# Altium project rgb_card.PrjPcb (part 2 of 4)

## Sheet memory.SchDoc
size A4
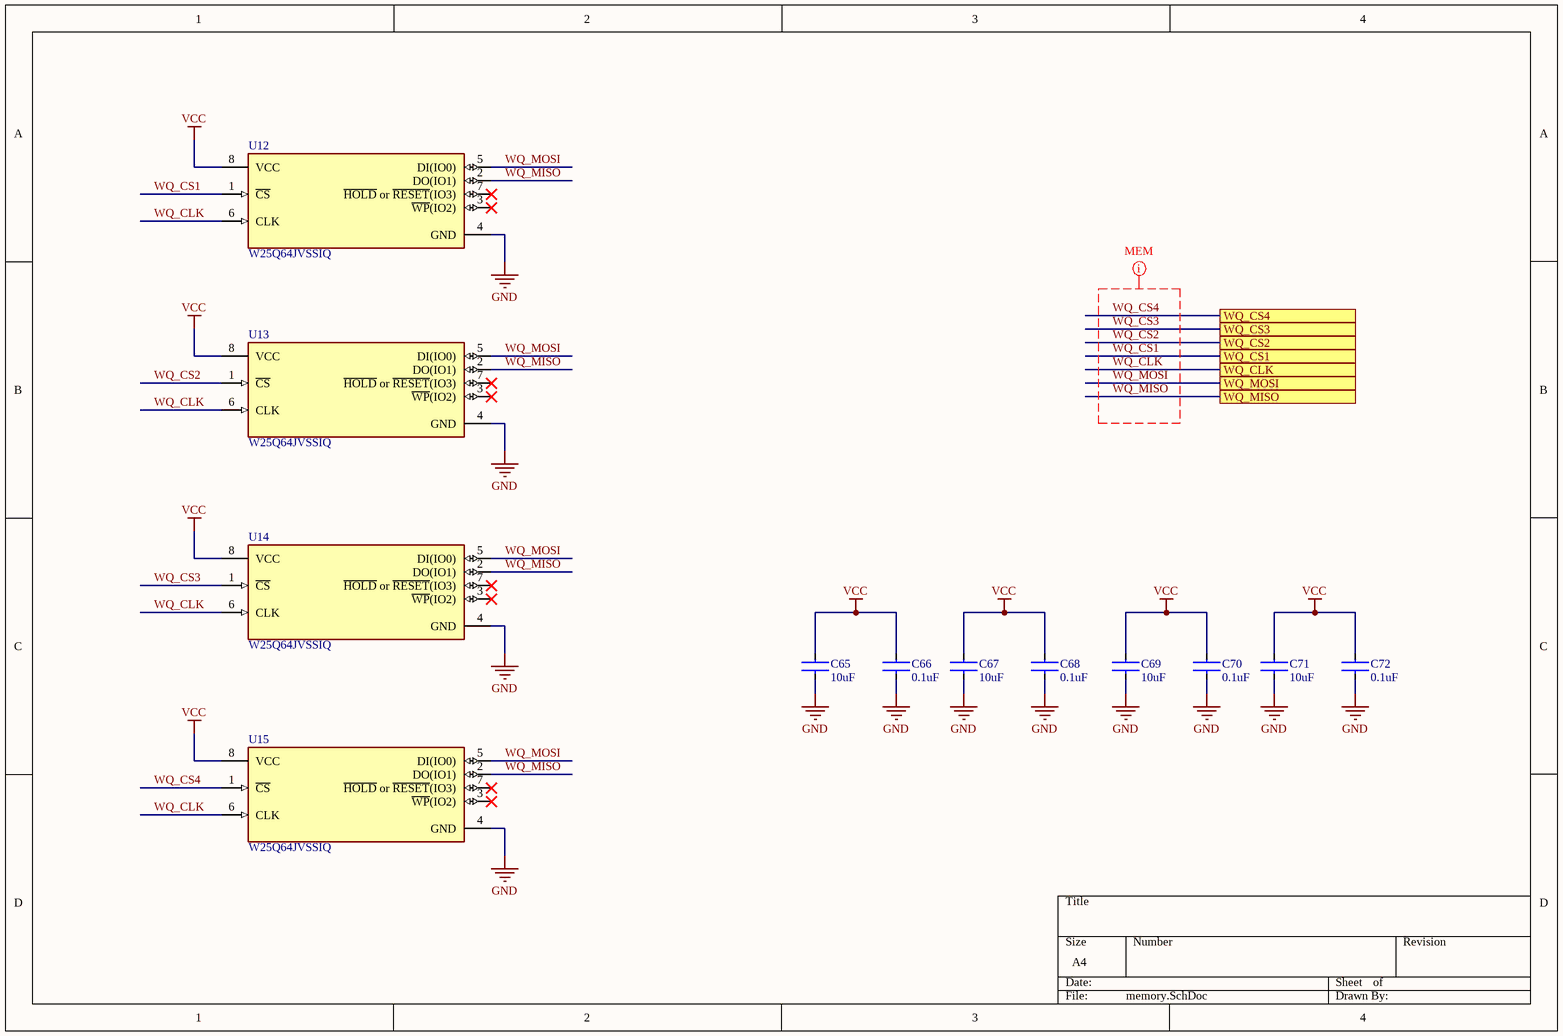
[diagram p5: memory.SchDoc]

### Parts
C65  10uF  [C0402]
C66  0.1uF  [C0402]
C67  10uF  [C0402]
C68  0.1uF  [C0402]
C69  10uF  [C0402]
C70  0.1uF  [C0402]
C71  10uF  [C0402]
C72  0.1uF  [C0402]
U12  W25Q64JVSSIQ  [SOIC-8]
U13  W25Q64JVSSIQ  [SOIC-8]
U14  W25Q64JVSSIQ  [SOIC-8]
U15  W25Q64JVSSIQ  [SOIC-8]

### Ports
WQ_CLK, WQ_CS1, WQ_CS2, WQ_CS3, WQ_CS4, WQ_MISO, WQ_MOSI

### Nets
GND: C65.2 C66.2 C67.2 C68.2 C69.2 C70.2 C71.2 C72.2 U12.4(GND) U13.4(GND) U14.4(GND) U15.4(GND)
VCC: C65.1 C66.1 C67.1 C68.1 C69.1 C70.1 C71.1 C72.1 U12.8(VCC) U13.8(VCC) U14.8(VCC) U15.8(VCC)
WQ_CLK: U12.6(CLK) U13.6(CLK) U14.6(CLK) U15.6(CLK) ; port WQ_CLK  [project net MEM_SCK]
WQ_CS1: U12.1(~{CS}) ; port WQ_CS1  [project net MEM_CS1]
WQ_CS2: U13.1(~{CS}) ; port WQ_CS2  [project net MEM_CS2]
WQ_CS3: U14.1(~{CS}) ; port WQ_CS3  [project net MEM_CS3]
WQ_CS4: U15.1(~{CS}) ; port WQ_CS4  [project net MEM_CS4]
WQ_MISO: U12.2(DO(IO1)) U13.2(DO(IO1)) U14.2(DO(IO1)) U15.2(DO(IO1)) ; port WQ_MISO  [project net MEM_MOSI]
WQ_MOSI: U12.5(DI(IO0)) U13.5(DI(IO0)) U14.5(DI(IO0)) U15.5(DI(IO0)) ; port WQ_MOSI  [project net MEM_MISO]

Not connected (* = marked no-connect by the designer): U12 3(~{WP}(IO2))* 7(~{HOLD}_or_~{RESET}(IO3))*; U13 3(~{WP}(IO2))* 7(~{HOLD}_or_~{RESET}(IO3))*; U14 3(~{WP}(IO2))* 7(~{HOLD}_or_~{RESET}(IO3))*; U15 3(~{WP}(IO2))* 7(~{HOLD}_or_~{RESET}(IO3))*

### Layout directives
net class MEM: WQ_CLK, WQ_CS1, WQ_CS2, WQ_CS3, WQ_CS4, WQ_MISO, WQ_MOSI

### Library data of the parts
C65 C67 C69 C71 = CL31B106KOHNNNE: Cap Ceramic 10uF 16V X7R 10% Pad SMD 1206 125°C T/R; Manufacturer: Samsung; Supplier 1: Future Electronics; Manufacturer Part Number: CL31B106KOHNNNE; RoHS: Yes; Category: Ceramic Capacitors; Stock 1: 116000; Pricing 1: 2000=0.03800, 6000=0.03460, 8000=0.03450, 20000=0.03420, 30000=0.03400 (USD); Mount: Surface Mount; Case/Package: 1206; Case Code (Metric): 3216; Case Code (Imperial): 1206; Material: Ceramic; Contact Plating: Tin; Min Operating Temperature: -55°C; Max Operating Temperature: 125°C; Capacitance: 10uF; Tolerance: 10%; Dielectric: X7R; Package Quantity: 1; Packaging: Tape and Reel; Voltage Rating: 16V; Series: CL; Length: 3.2mm; Width: 0.063inch; Height: 1.6mm; Thickness: 0.071inch; Depth: 1.6mm; RoHS Compliant: Yes; ComponentLink1URL: https://datasheet.ciiva.com/25795/cl31b106kohnnne-25795201.pdf?src-supplier=Digi-Key; ComponentLink1Description: https://datasheet.ciiva.com/25795/cl31b106kohnnne-25795201.pdf?src-supplier=Digi-Key; ComponentLink2URL: https://datasheet.ciiva.com/29201/452535-da-01-en-vs-kondensator-1206-29201132.pdf?src-supplier=Conrad; ComponentLink2Description: https://datasheet.ciiva.com/29201/452535-da-01-en-vs-kondensator-1206-29201132.pdf?src-supplier=Conrad; Supplier Part Number 1: 2558872
C66 C68 C70 C72 = CL31B104KBCNNNC: Ceramic capacitor SMD-1206 100nF /50V X7R# K +-10%, Samsung, RoHS; Tolerance: 10%; Dielectric: X7R; Voltage: 50V; Supplier 1: Arrow Electronics; Manufacturer: Samsung; Manufacturer Part Number: CL31B104KBCNNNC; RoHS: Yes; Category: Ceramic Capacitors; Stock 1: 3508000; Pricing 1: 4000=0.02060, 8000=0.01660 (USD); Mount: Surface Mount; Case/Package: 1206; Case Code (Metric): 3216; Case Code (Imperial): 1206; Material: Ceramic; Contact Plating: Tin; Min Operating Temperature: -55°C; Max Operating Temperature: 125°C; Capacitance: 100nF; Voltage Rating (DC): 50V; Packaging: Tape and Reel; Voltage Rating: 50V; Series: CL; Length: 3.2mm; Width: 0.063inch; Height: 0.85mm; Depth: 1.6mm; Thickness: 0.037inch; Radiation Hardening: No; Lead Free: Lead Free; RoHS Compliant: Yes; ComponentLink1URL: https://datasheet.ciiva.com/25710/cl31b104kbcnnnc-25710293.pdf?src-supplier=Digi-Key; ComponentLink1Description: https://datasheet.ciiva.com/25710/cl31b104kbcnnnc-25710293.pdf?src-supplier=Digi-Key; ComponentLink2URL: https://datasheet.ciiva.com/29201/451941-da-01-en-vs-kondensator-1206-29201689.pdf?src-supplier=Conrad; ComponentLink2Description: https://datasheet.ciiva.com/29201/451941-da-01-en-vs-kondensator-1206-29201689.pdf?src-supplier=Conrad; ComponentLink3URL: https://datasheet.ciiva.com/16298/cl05b104kq5nnnc-16298186.pdf?src-supplier=Future+Electronics; ComponentLink3Description: https://datasheet.ciiva.com/16298/cl05b104kq5nnnc-16298186.pdf?src-supplier=Future+Electronics; Supplier Part Number 1: CL31B104KBCNNNC
U12-U15 = W25Q64JVSSIQ: IC FLASH 64MBIT 104MHZ 8SOIC; Manufacturer: Winbond; Memory Type: FLASH,NOR; Interface: SPI,Serial; Max Supply Voltage: 3.6V; Min Supply Voltage: 2.7V; Page Size: 256B; Density: 64MB; Operating Supply Voltage: 3V; Address Bus Width: 24b; Access Time: 6ns; Supplier 1: Arrow Electronics; Manufacturer Part Number: W25Q64JVSSIQ; RoHS: Yes; Category: Flash; Stock 1: 24923; Pricing 1: 1=1.14900, 10=1.03090, 25=1.01110, 50=1.00110, 100=0.92440, 250=0.91670, 500=0.90340, 1000=0.87160, 5000=0.77800 (USD); Mount: Surface Mount; Case/Package: SOIC; Number of Pins: 8; Min Operating Temperature: -40°C; Max Operating Temperature: 85°C; Packaging: Tray; Frequency: 104MHz; RoHS Compliant: Yes; ComponentLink1URL: http://www.winbond.com/resource-files/w25q64jv%20revj%2003272018%20plus.pdf?src-supplier=Digi-Key; ComponentLink1Description: http://www.winbond.com/resource-files/w25q64jv%20revj%2003272018%20plus.pdf?src-supplier=Digi-Key; Supplier Part Number 1: W25Q64JVSSIQ

## Sheet wifi.SchDoc
size A
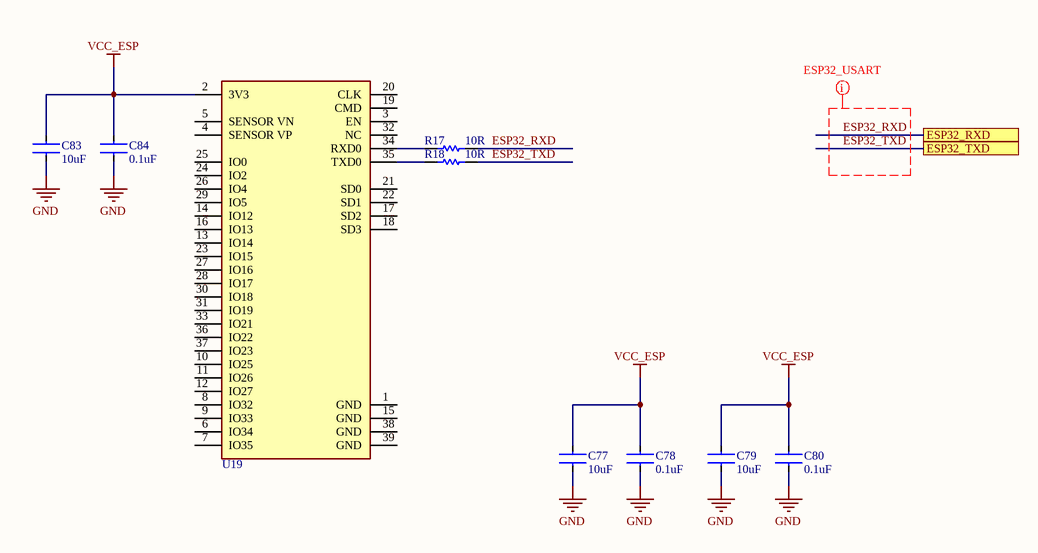
[diagram p6: wifi.SchDoc]

### Parts
C77  10uF  [C0402]
C78  0.1uF  [C0402]
C79  10uF  [C0402]
C80  0.1uF  [C0402]
C83  10uF  [C0402]
C84  0.1uF  [C0402]
R17  10R  [R0402]
R18  10R  [R0402]
U19  BLE/WIFI Module  [Espressif_ESP-WROOM-32_0]  (value not drawn)

### Ports
ESP32_RXD, ESP32_TXD

### Nets
GND: C77.2 C78.2 C79.2 C80.2 C83.2 C84.2
VCC_ESP: C77.1 C78.1 C79.1 C80.1 C83.1 C84.1 U19.2(3V3)  [project net ETH_VCC]
ESP32_RXD: R17.2 ; port ESP32_RXD
ESP32_TXD: R18.2 ; port ESP32_TXD
NetR17_1: R17.1 U19.34(RXD0)
NetR18_1: R18.1 U19.35(TXD0)

Not connected (* = marked no-connect by the designer): U19 1(GND) 3(EN) 4(SENSOR_VP) 5(SENSOR_VN) 6(IO34) 7(IO35) 8(IO32) 9(IO33) 10(IO25) 11(IO26) 12(IO27) 13(IO14) 14(IO12) 15(GND) 16(IO13) 17(SD2) 18(SD3) 19(CMD) 20(CLK) 21(SD0) 22(SD1) 23(IO15) 24(IO2) 25(IO0) 26(IO4) 27(IO16) 28(IO17) 29(IO5) 30(IO18) 31(IO19) 32(NC) 33(IO21) 36(IO22) 37(IO23) 38(GND) 39(GND)

### Layout directives
net class USP32_USART: ESP32_RXD, ESP32_TXD

### Library data of the parts
C77 C79 C83 = CL31B106KOHNNNE: as C65 on sheet memory; Supplier 1: Future Electronics; Manufacturer Part Number: CL31B106KOHNNNE; RoHS: Yes; Category: Ceramic Capacitors; Stock 1: 116000; Pricing 1: 2000=0.03800, 6000=0.03460, 8000=0.03450, 20000=0.03420, 30000=0.03400 (USD); Mount: Surface Mount; Case/Package: 1206; Case Code (Metric): 3216; Case Code (Imperial): 1206; Material: Ceramic; Contact Plating: Tin; Min Operating Temperature: -55°C; Max Operating Temperature: 125°C; Capacitance: 10uF; Tolerance: 10%; Dielectric: X7R; Package Quantity: 1; Packaging: Tape and Reel; Voltage Rating: 16V; Series: CL; Length: 3.2mm; Width: 0.063inch; Height: 1.6mm; Thickness: 0.071inch; Depth: 1.6mm; RoHS Compliant: Yes; ComponentLink1URL: https://datasheet.ciiva.com/25795/cl31b106kohnnne-25795201.pdf?src-supplier=Digi-Key; ComponentLink1Description: https://datasheet.ciiva.com/25795/cl31b106kohnnne-25795201.pdf?src-supplier=Digi-Key; ComponentLink2URL: https://datasheet.ciiva.com/29201/452535-da-01-en-vs-kondensator-1206-29201132.pdf?src-supplier=Conrad; ComponentLink2Description: https://datasheet.ciiva.com/29201/452535-da-01-en-vs-kondensator-1206-29201132.pdf?src-supplier=Conrad; Supplier Part Number 1: 2558872
C78 C80 C84 = CL31B104KBCNNNC: as C66 on sheet memory; Supplier 1: Arrow Electronics; Manufacturer: Samsung; Manufacturer Part Number: CL31B104KBCNNNC; RoHS: Yes; Category: Ceramic Capacitors; Stock 1: 3508000; Pricing 1: 4000=0.02060, 8000=0.01660 (USD); Mount: Surface Mount; Case/Package: 1206; Case Code (Metric): 3216; Case Code (Imperial): 1206; Material: Ceramic; Contact Plating: Tin; Min Operating Temperature: -55°C; Max Operating Temperature: 125°C; Capacitance: 100nF; Voltage Rating (DC): 50V; Packaging: Tape and Reel; Voltage Rating: 50V; Series: CL; Length: 3.2mm; Width: 0.063inch; Height: 0.85mm; Depth: 1.6mm; Thickness: 0.037inch; Radiation Hardening: No; Lead Free: Lead Free; RoHS Compliant: Yes; ComponentLink1URL: https://datasheet.ciiva.com/25710/cl31b104kbcnnnc-25710293.pdf?src-supplier=Digi-Key; ComponentLink1Description: https://datasheet.ciiva.com/25710/cl31b104kbcnnnc-25710293.pdf?src-supplier=Digi-Key; ComponentLink2URL: https://datasheet.ciiva.com/29201/451941-da-01-en-vs-kondensator-1206-29201689.pdf?src-supplier=Conrad; ComponentLink2Description: https://datasheet.ciiva.com/29201/451941-da-01-en-vs-kondensator-1206-29201689.pdf?src-supplier=Conrad; ComponentLink3URL: https://datasheet.ciiva.com/16298/cl05b104kq5nnnc-16298186.pdf?src-supplier=Future+Electronics; ComponentLink3Description: https://datasheet.ciiva.com/16298/cl05b104kq5nnnc-16298186.pdf?src-supplier=Future+Electronics; Supplier Part Number 1: CL31B104KBCNNNC
R17 R18 = RC1206FR-0710RL: Res Thick Film 1206 10 Ohm 1% 0.25W(1/4W) +/-200ppm/ßC Epoxy SMD T/R; Manufacturer: Yageo; Temperature Coefficient: 200ppm/°C; Voltage Rating (DC): 200V; Power Rating: 250mW; Supplier 1: Arrow Electronics; Manufacturer Part Number: RC1206FR-0710RL; RoHS: Yes; Category: Chip SMD Resistors; Stock 1: 60000; Pricing 1: 5000=0.02280 (USD); Case/Package: 1206; Number of Pins: 2; Case Code (Metric): 3216; Case Code (Imperial): 1206; Size Code: 1206; Min Operating Temperature: -55°C; Max Operating Temperature: 155°C; Tolerance: 1%; Resistance: 10R; Resistor Type: Thick Film; Packaging: Tape and Reel; Package Quantity: 1; Voltage Rating: 200V; Number of Terminations: 2; Termination: SMD/SMT; Max Power Dissipation: 250mW; Features: Moisture Resistant; Series: RC; Resistance Tolerance: 1%; Technology: THICK FILM; Construction: Rectangular; Length: 3.1mm; Width: 0.063inch; Height: 0.026inch; Depth: 1.6mm; REACH SVHC: Unknown; Lead Free: Lead Free; Military Standard: Not; RoHS Compliant: Yes; ComponentLink1URL: https://datasheet.ciiva.com/11819/0900766b80c6630a-11819896.pdf?src-supplier=RSComponents; ComponentLink1Description: https://datasheet.ciiva.com/11819/0900766b80c6630a-11819896.pdf?src-supplier=RSComponents; ComponentLink2URL: https://datasheet.ciiva.com/22735/444357-22735648.pdf?src-supplier=Farnell; ComponentLink2Description: https://datasheet.ciiva.com/22735/444357-22735648.pdf?src-supplier=Farnell; ComponentLink3URL: https://datasheet.ciiva.com/29181/402303-da-01-en-smd-widerstand-chip1206-10-ohm-29181572.pdf?src-supplier=Conrad; ComponentLink3Description: https://datasheet.ciiva.com/29181/402303-da-01-en-smd-widerstand-chip1206-10-ohm-29181572.pdf?src-supplier=Conrad; ComponentLink4URL: https://datasheet.ciiva.com/46445/444357-46445704.pdf?src-supplier=Element14; ComponentLink4Description: https://datasheet.ciiva.com/46445/444357-46445704.pdf?src-supplier=Element14; ComponentLink5URL: https://datasheet.ciiva.com/2460/pyu-rc1206-51-rohs-l-4-2460049.pdf?src-supplier=Digi-Key; ComponentLink5Description: https://datasheet.ciiva.com/2460/pyu-rc1206-51-rohs-l-4-2460049.pdf?src-supplier=Digi-Key; ComponentLink6URL: https://datasheet.ciiva.com/2460/pyu-rc1206-51-rohs-l-4-2460050.pdf?src-supplier=Digi-Key; ComponentLink6Description: https://datasheet.ciiva.com/2460/pyu-rc1206-51-rohs-l-4-2460050.pdf?src-supplier=Digi-Key; ComponentLink7URL: https://datasheet.ciiva.com/2460/pyu-rc1206-51-rohs-l-4-2460048.pdf?src-supplier=Digi-Key; ComponentLink7Description: https://datasheet.ciiva.com/2460/pyu-rc1206-51-rohs-l-4-2460048.pdf?src-supplier=Digi-Key; ComponentLink8URL: https://datasheet.ciiva.com/16962/pyu-rc1206-51-rohs-l-4-16962857.pdf?src-supplier=Future+Electronics; ComponentLink8Description: https://datasheet.ciiva.com/16962/pyu-rc1206-51-rohs-l-4-16962857.pdf?src-supplier=Future+Electronics; Supplier Part Number 1: RC1206FR-0710RL
U19 = IC_Espressif_ESP-WROOM-32_eec: IC SPRESSIF ESP32 BLUETOOTH WIFI Module; helpURL: https://upverter.com/upn/revision/247263e65b82b491/; ComponentLink2Description: Datasheet; Temperature: -40°C to +85°C; Package: MOD_SMT; Supplier 2: Mouser; Supplier 1: Digi-Key; ComponentLink1URL: https://upverter.com/upn/revision/247263e65b82b491/; Supplier Part Number 2: 485-3320; Supplier Part Number 1: 1188-1178-ND; Manufacturer: Espressif; ComponentLink1Description: Upverter; ComponentLink2URL: http://www.espressif.com/sites/default/files/documentation/esp-wroom-32_datasheet_en.pdf; RoHS: TRUE; Mouser Part Number: 485-3320; Temperature Range High: +85°C; Digikey Description: IC SPRESSIF ESP32 BLUETOOTH WIFI M; Digikey Part Number: 1188-1178-ND; Lead Free: yes; Temperature Range Low: -40°C; Part Number: ESP-WROOM-32

## Sheet hub75d.SchDoc
size A3
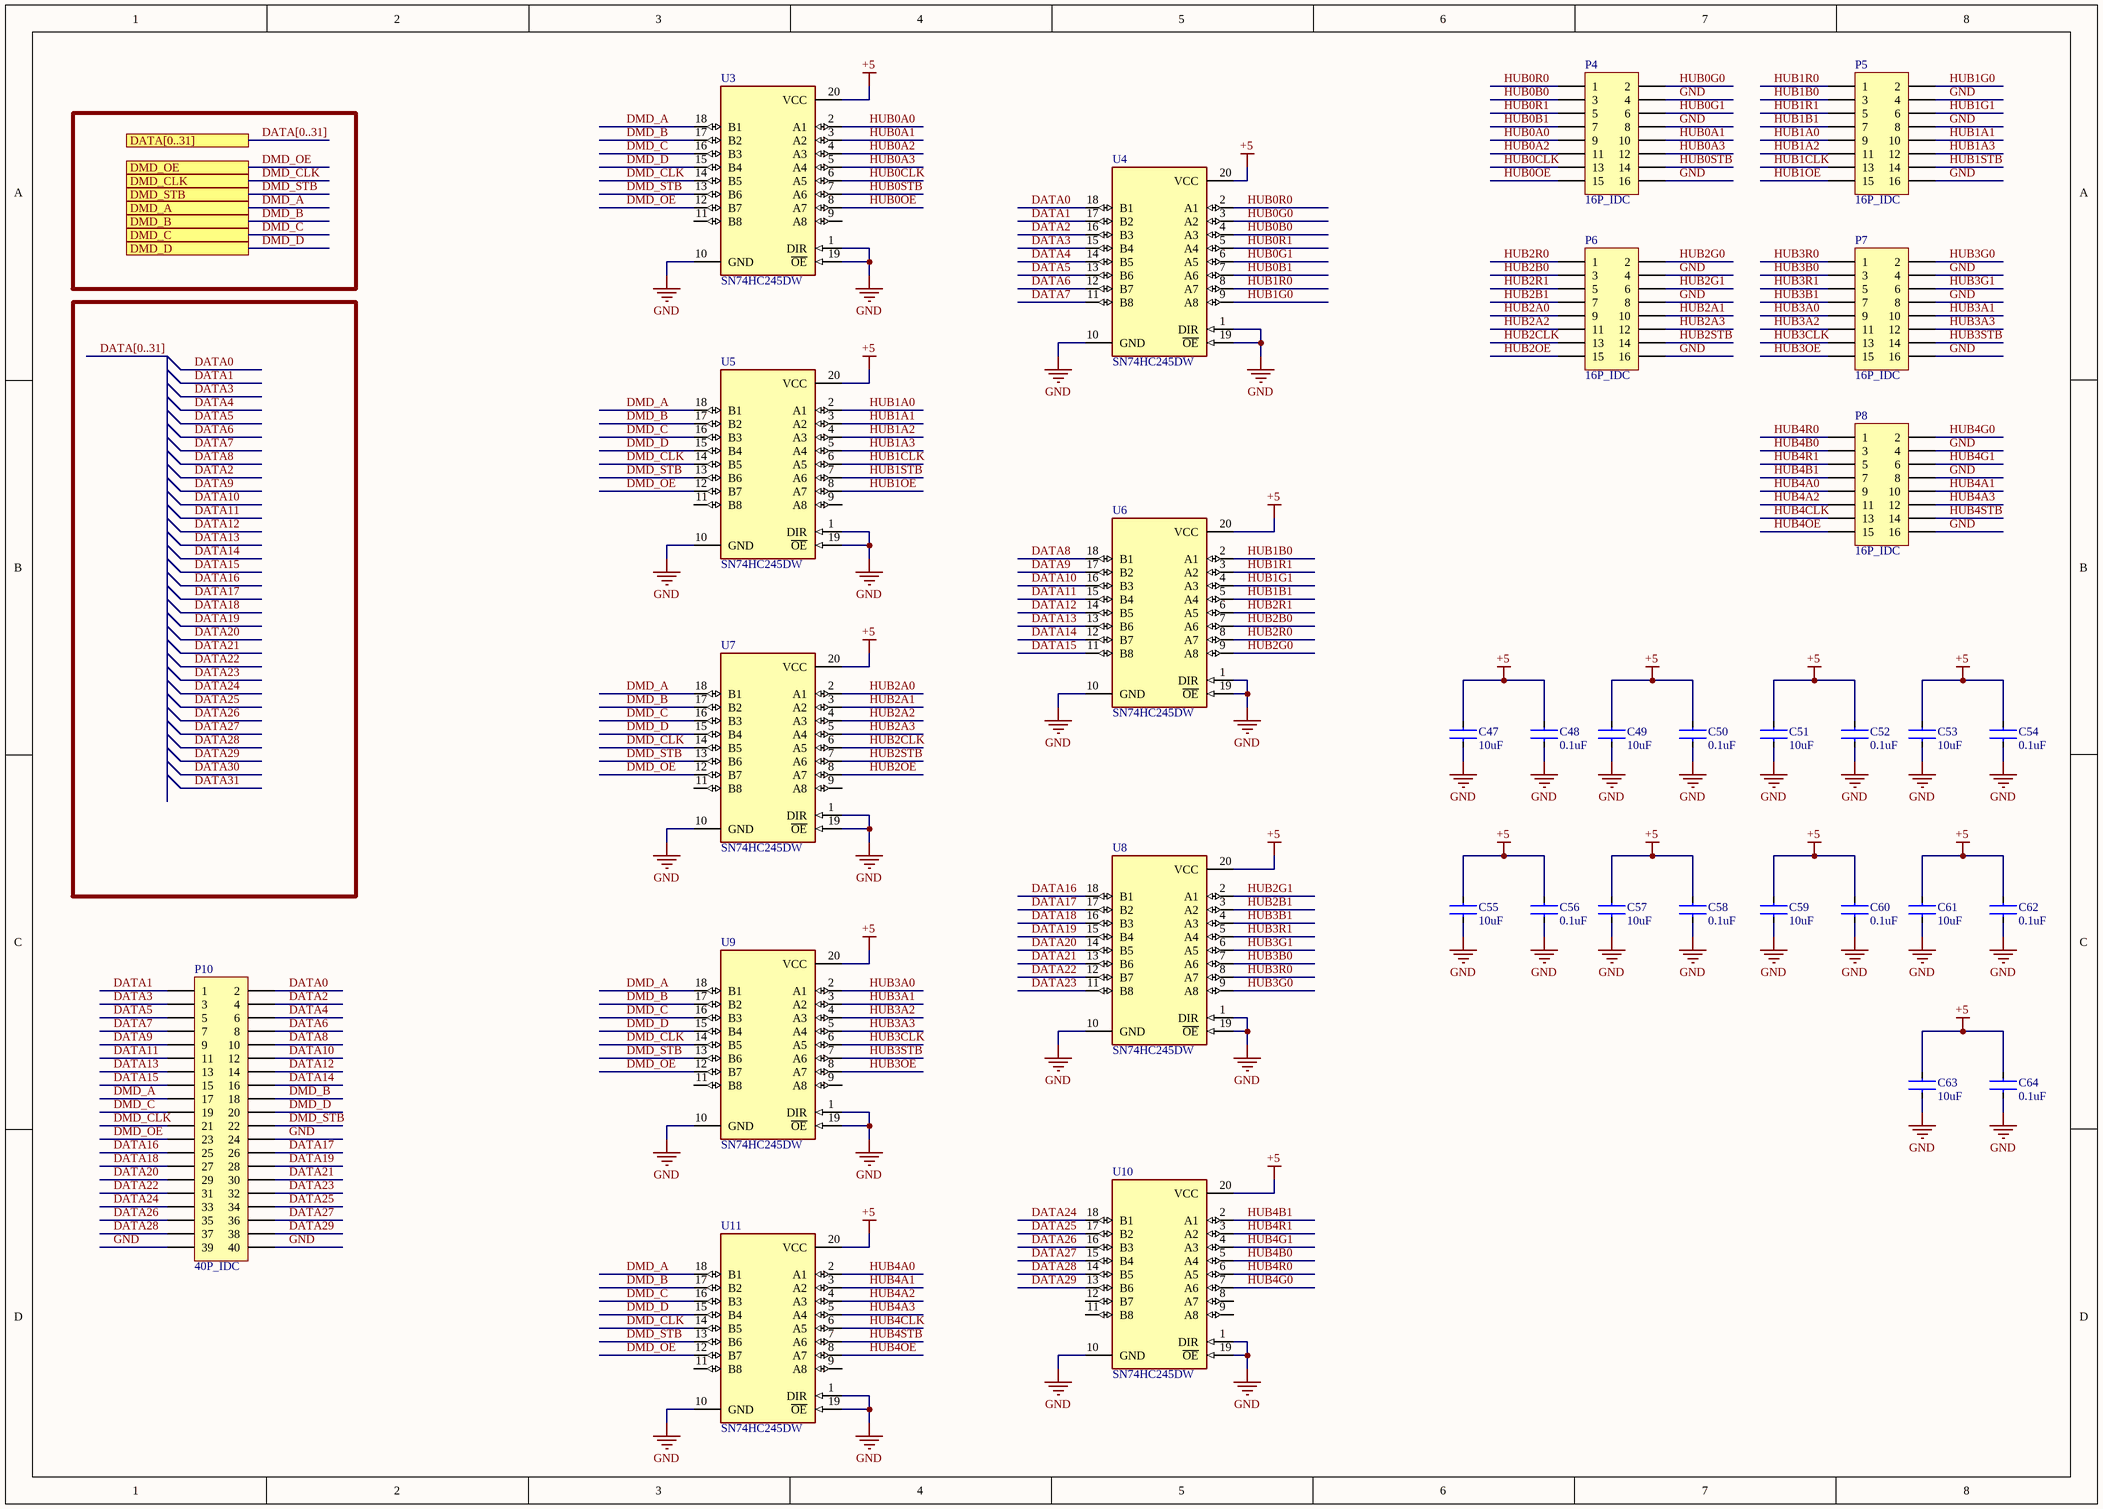
[diagram p7: hub75d.SchDoc]

### Parts
C47  10uF  [C0402]
C48  0.1uF  [C0402]
C49  10uF  [C0402]
C50  0.1uF  [C0402]
C51  10uF  [C0402]
C52  0.1uF  [C0402]
C53  10uF  [C0402]
C54  0.1uF  [C0402]
C55  10uF  [C0402]
C56  0.1uF  [C0402]
C57  10uF  [C0402]
C58  0.1uF  [C0402]
C59  10uF  [C0402]
C60  0.1uF  [C0402]
C61  10uF  [C0402]
C62  0.1uF  [C0402]
C63  10uF  [C0402]
C64  0.1uF  [C0402]
P4  16P_IDC  [16Pin_IDC_Connector]
P5  16P_IDC  [16Pin_IDC_Connector]
P6  16P_IDC  [16Pin_IDC_Connector]
P7  16P_IDC  [16Pin_IDC_Connector]
P8  16P_IDC  [16Pin_IDC_Connector]
P10  40P_IDC  [40Pin_IDC_Connector]
U3  SN74HC245DW  [DB20]
U4  SN74HC245DW  [DB20]
U5  SN74HC245DW  [DB20]
U6  SN74HC245DW  [DB20]
U7  SN74HC245DW  [DB20]
U8  SN74HC245DW  [DB20]
U9  SN74HC245DW  [DB20]
U10  SN74HC245DW  [DB20]
U11  SN74HC245DW  [DB20]

### Ports
DATA[0..31], DMD_A, DMD_B, DMD_C, DMD_CLK, DMD_D, DMD_OE, DMD_STB

### Nets
+5: C47.1 C48.1 C49.1 C50.1 C51.1 C52.1 C53.1 C54.1 C55.1 C56.1 C57.1 C58.1 C59.1 C60.1 C61.1 C62.1 C63.1 C64.1 U3.20(VCC) U4.20(VCC) U5.20(VCC) U6.20(VCC) U7.20(VCC) U8.20(VCC) U9.20(VCC) U10.20(VCC) U11.20(VCC)
GND: C47.2 C48.2 C49.2 C50.2 C51.2 C52.2 C53.2 C54.2 C55.2 C56.2 C57.2 C58.2 C59.2 C60.2 C61.2 C62.2 C63.2 C64.2 P4.4 P4.8 P4.16 P5.4 P5.8 P5.16 P6.4 P6.8 P6.16 P7.4 P7.8 P7.16 P8.4 P8.8 P8.16 P10.24 P10.39 P10.40 U3.1(DIR) U3.10(GND) U3.19(~{OE}) U4.1(DIR) U4.10(GND) U4.19(~{OE}) U5.1(DIR) U5.10(GND) U5.19(~{OE}) U6.1(DIR) U6.10(GND) U6.19(~{OE}) U7.1(DIR) U7.10(GND) U7.19(~{OE}) U8.1(DIR) U8.10(GND) U8.19(~{OE}) U9.1(DIR) U9.10(GND) U9.19(~{OE}) U10.1(DIR) U10.10(GND) U10.19(~{OE}) U11.1(DIR) U11.10(GND) U11.19(~{OE})
DATA0: P10.2 U4.18(B1)
DATA1: P10.1 U4.17(B2)
DATA2: P10.4 U4.16(B3)
DATA3: P10.3 U4.15(B4)
DATA4: P10.6 U4.14(B5)
DATA5: P10.5 U4.13(B6)
DATA6: P10.8 U4.12(B7)
DATA7: P10.7 U4.11(B8)
DATA8: P10.10 U6.18(B1)
DATA9: P10.9 U6.17(B2)
DATA10: P10.12 U6.16(B3)
DATA11: P10.11 U6.15(B4)
DATA12: P10.14 U6.14(B5)
DATA13: P10.13 U6.13(B6)
DATA14: P10.16 U6.12(B7)
DATA15: P10.15 U6.11(B8)
DATA16: P10.25 U8.18(B1)
DATA17: P10.26 U8.17(B2)
DATA18: P10.27 U8.16(B3)
DATA19: P10.28 U8.15(B4)
DATA20: P10.29 U8.14(B5)
DATA21: P10.30 U8.13(B6)
DATA22: P10.31 U8.12(B7)
DATA23: P10.32 U8.11(B8)
DATA24: P10.33 U10.18(B1)
DATA25: P10.34 U10.17(B2)
DATA26: P10.35 U10.16(B3)
DATA27: P10.36 U10.15(B4)
DATA28: P10.37 U10.14(B5)
DATA29: P10.38 U10.13(B6)
DMD_A: P10.17 U3.18(B1) U5.18(B1) U7.18(B1) U9.18(B1) U11.18(B1) ; port DMD_A
DMD_B: P10.18 U3.17(B2) U5.17(B2) U7.17(B2) U9.17(B2) U11.17(B2) ; port DMD_B
DMD_C: P10.19 U3.16(B3) U5.16(B3) U7.16(B3) U9.16(B3) U11.16(B3) ; port DMD_C
DMD_CLK: P10.21 U3.14(B5) U5.14(B5) U7.14(B5) U9.14(B5) U11.14(B5) ; port DMD_CLK
DMD_D: P10.20 U3.15(B4) U5.15(B4) U7.15(B4) U9.15(B4) U11.15(B4) ; port DMD_D
DMD_OE: P10.23 U3.12(B7) U5.12(B7) U7.12(B7) U9.12(B7) U11.12(B7) ; port DMD_OE
DMD_STB: P10.22 U3.13(B6) U5.13(B6) U7.13(B6) U9.13(B6) U11.13(B6) ; port DMD_STB
HUB0A0: P4.9 U3.2(A1)
HUB0A1: P4.10 U3.3(A2)
HUB0A2: P4.11 U3.4(A3)
HUB0A3: P4.12 U3.5(A4)
HUB0B0: P4.3 U4.4(A3)
HUB0B1: P4.7 U4.7(A6)
HUB0CLK: P4.13 U3.6(A5)
HUB0G0: P4.2 U4.3(A2)
HUB0G1: P4.6 U4.6(A5)
HUB0OE: P4.15 U3.8(A7)
HUB0R0: P4.1 U4.2(A1)
HUB0R1: P4.5 U4.5(A4)
HUB0STB: P4.14 U3.7(A6)
HUB1A0: P5.9 U5.2(A1)
HUB1A1: P5.10 U5.3(A2)
HUB1A2: P5.11 U5.4(A3)
HUB1A3: P5.12 U5.5(A4)
HUB1B0: P5.3 U6.2(A1)
HUB1B1: P5.7 U6.5(A4)
HUB1CLK: P5.13 U5.6(A5)
HUB1G0: P5.2 U4.9(A8)
HUB1G1: P5.6 U6.4(A3)
HUB1OE: P5.15 U5.8(A7)
HUB1R0: P5.1 U4.8(A7)
HUB1R1: P5.5 U6.3(A2)
HUB1STB: P5.14 U5.7(A6)
HUB2A0: P6.9 U7.2(A1)
HUB2A1: P6.10 U7.3(A2)
HUB2A2: P6.11 U7.4(A3)
HUB2A3: P6.12 U7.5(A4)
HUB2B0: P6.3 U6.7(A6)
HUB2B1: P6.7 U8.3(A2)
HUB2CLK: P6.13 U7.6(A5)
HUB2G0: P6.2 U6.9(A8)
HUB2G1: P6.6 U8.2(A1)
HUB2OE: P6.15 U7.8(A7)
HUB2R0: P6.1 U6.8(A7)
HUB2R1: P6.5 U6.6(A5)
HUB2STB: P6.14 U7.7(A6)
HUB3A0: P7.9 U9.2(A1)
HUB3A1: P7.10 U9.3(A2)
HUB3A2: P7.11 U9.4(A3)
HUB3A3: P7.12 U9.5(A4)
HUB3B0: P7.3 U8.7(A6)
HUB3B1: P7.7 U8.4(A3)
HUB3CLK: P7.13 U9.6(A5)
HUB3G0: P7.2 U8.9(A8)
HUB3G1: P7.6 U8.6(A5)
HUB3OE: P7.15 U9.8(A7)
HUB3R0: P7.1 U8.8(A7)
HUB3R1: P7.5 U8.5(A4)
HUB3STB: P7.14 U9.7(A6)
HUB4A0: P8.9 U11.2(A1)
HUB4A1: P8.10 U11.3(A2)
HUB4A2: P8.11 U11.4(A3)
HUB4A3: P8.12 U11.5(A4)
HUB4B0: P8.3 U10.5(A4)
HUB4B1: P8.7 U10.2(A1)
HUB4CLK: P8.13 U11.6(A5)
HUB4G0: P8.2 U10.7(A6)
HUB4G1: P8.6 U10.4(A3)
HUB4OE: P8.15 U11.8(A7)
HUB4R0: P8.1 U10.6(A5)
HUB4R1: P8.5 U10.3(A2)
HUB4STB: P8.14 U11.7(A6)

Not connected (* = marked no-connect by the designer): U3 9(A8) 11(B8); U5 9(A8) 11(B8); U7 9(A8) 11(B8); U9 9(A8) 11(B8); U10 8(A7) 9(A8) 11(B8) 12(B7); U11 9(A8) 11(B8)

### Buses and harness runs
bus DATA[0..31]
bus DATA[0..31] = port DATA[0..31]

### Library data of the parts
C47 C49 C51 C53 C55 C57 C59 C61 C63 = CL31B106KOHNNNE: as C65 on sheet memory; Supplier 1: Future Electronics; Manufacturer Part Number: CL31B106KOHNNNE; RoHS: Yes; Category: Ceramic Capacitors; Stock 1: 116000; Pricing 1: 2000=0.03800, 6000=0.03460, 8000=0.03450, 20000=0.03420, 30000=0.03400 (USD); Mount: Surface Mount; Case/Package: 1206; Case Code (Metric): 3216; Case Code (Imperial): 1206; Material: Ceramic; Contact Plating: Tin; Min Operating Temperature: -55°C; Max Operating Temperature: 125°C; Capacitance: 10uF; Tolerance: 10%; Dielectric: X7R; Package Quantity: 1; Packaging: Tape and Reel; Voltage Rating: 16V; Series: CL; Length: 3.2mm; Width: 0.063inch; Height: 1.6mm; Thickness: 0.071inch; Depth: 1.6mm; RoHS Compliant: Yes; ComponentLink1URL: https://datasheet.ciiva.com/25795/cl31b106kohnnne-25795201.pdf?src-supplier=Digi-Key; ComponentLink1Description: https://datasheet.ciiva.com/25795/cl31b106kohnnne-25795201.pdf?src-supplier=Digi-Key; ComponentLink2URL: https://datasheet.ciiva.com/29201/452535-da-01-en-vs-kondensator-1206-29201132.pdf?src-supplier=Conrad; ComponentLink2Description: https://datasheet.ciiva.com/29201/452535-da-01-en-vs-kondensator-1206-29201132.pdf?src-supplier=Conrad; Supplier Part Number 1: 2558872
C48 C50 C52 C54 C56 C58 C60 C62 C64 = CL31B104KBCNNNC: as C66 on sheet memory; Supplier 1: Arrow Electronics; Manufacturer: Samsung; Manufacturer Part Number: CL31B104KBCNNNC; RoHS: Yes; Category: Ceramic Capacitors; Stock 1: 3508000; Pricing 1: 4000=0.02060, 8000=0.01660 (USD); Mount: Surface Mount; Case/Package: 1206; Case Code (Metric): 3216; Case Code (Imperial): 1206; Material: Ceramic; Contact Plating: Tin; Min Operating Temperature: -55°C; Max Operating Temperature: 125°C; Capacitance: 100nF; Voltage Rating (DC): 50V; Packaging: Tape and Reel; Voltage Rating: 50V; Series: CL; Length: 3.2mm; Width: 0.063inch; Height: 0.85mm; Depth: 1.6mm; Thickness: 0.037inch; Radiation Hardening: No; Lead Free: Lead Free; RoHS Compliant: Yes; ComponentLink1URL: https://datasheet.ciiva.com/25710/cl31b104kbcnnnc-25710293.pdf?src-supplier=Digi-Key; ComponentLink1Description: https://datasheet.ciiva.com/25710/cl31b104kbcnnnc-25710293.pdf?src-supplier=Digi-Key; ComponentLink2URL: https://datasheet.ciiva.com/29201/451941-da-01-en-vs-kondensator-1206-29201689.pdf?src-supplier=Conrad; ComponentLink2Description: https://datasheet.ciiva.com/29201/451941-da-01-en-vs-kondensator-1206-29201689.pdf?src-supplier=Conrad; ComponentLink3URL: https://datasheet.ciiva.com/16298/cl05b104kq5nnnc-16298186.pdf?src-supplier=Future+Electronics; ComponentLink3Description: https://datasheet.ciiva.com/16298/cl05b104kq5nnnc-16298186.pdf?src-supplier=Future+Electronics; Supplier Part Number 1: CL31B104KBCNNNC
P4-P8 = BHR-16-VUA: Headers & Wire Housings 16P STRAIGHT; Manufacturer: Adam Equipment; Current Rating: 1A; Number of Positions: 16; Pitch: 2.54mm; Supplier 1: Digi-Key; Manufacturer Part Number: BHR-16-VUA; RoHS: Yes; Category: Connectors; Stock 1: 804; Pricing 1: 1=0.45000, 10=0.42400, 100=0.29690, 500=0.25452, 1000=0.21210, 5000=0.18180, 10000=0.16968 (USD); Contact Plating: Gold; Contact Material: Brass; Package Quantity: 276; Number of Rows: 2; Packaging: Tray; Orientation: Straight; Termination: IDC; Lead Free: Lead Free; ComponentLink1URL: https://datasheet.ciiva.com/16418/page-319-321-16418937.pdf?src-supplier=Future+Electronics; ComponentLink1Description: https://datasheet.ciiva.com/16418/page-319-321-16418937.pdf?src-supplier=Future+Electronics; Supplier Part Number 1: 2057-BHR-16-VUA-ND
P10 = BHR-40-VUA: Conn Shrouded Header (4 Sides) HDR 40 POS 2.54mm Solder ST Top Entry Thru-Hole Tray; Manufacturer: Adam Equipment; Manufacturer Part Number: BHR-20-VUA; Current Rating: 1A; Number of Positions: 20; Supplier 1: Digi-Key; RoHS: Yes; Category: Connectors; Stock 1: 1576; Pricing 1: 1=0.44000, 10=0.41700, 160=0.31944, 480=0.27775, 800=0.24998, 5120=0.20137, 10080=0.18748 (USD); Contact Material: Brass; Contact Plating: Gold; Number of Rows: 2; Packaging: Tray; Package Quantity: 216; Termination: IDC; Pitch: 2.54mm; Lead Free: Lead Free; ComponentLink1URL: https://datasheet.ciiva.com/16418/page-319-321-16418950.pdf?src-supplier=Future+Electronics; ComponentLink1Description: https://datasheet.ciiva.com/16418/page-319-321-16418950.pdf?src-supplier=Future+Electronics; Supplier Part Number 1: 2057-BHR-20-VUA-ND
U3-U11 = SN74HC245DW: Transceiver, Non-Inverting 1 Element 8 Bit per Element Push-Pull Output 20-SOIC; Manufacturer: Texas Instruments; Min Supply Voltage: 2V; Max Supply Voltage: 6V; Number of Channels: 8; Operating Supply Voltage: 5V; Number of Elements: 1; Direction: Bidirectional; Propagation Delay: 22ns; High Level Output Current: -7.8mA; Low Level Output Current: 7.8mA; Logic Function: Transceiver,Inverting; Turn-On Delay Time: 335ns; Quiescent Current: 8uA; Supplier 1: Rochester Electronics; Manufacturer Part Number: SN74HC245DW; RoHS: Yes; Category: Buffers, Drivers and Transceivers; Stock 1: 10523; Pricing 1: 1=0.59230, 25=0.58040, 100=0.56860, 500=0.55680, 1000=0.54490 (USD); Mount: Surface Mount; Case/Package: SOIC; Number of Pins: 20; Weight: 0.017662oz; Contact Plating: Gold; Min Operating Temperature: -40°C; Max Operating Temperature: 85°C; Packaging: Rail/Tube; Package Quantity: 25; Number of Bits per Element: 8; Number of Circuits: 8; Polarity: Non-Inverting; Number of Outputs: 8; Number of Bits: 8; Output Current: 7.8mA; Max Output Current: 7.8mA; Length: 12.8mm; Width: 7.52mm; Height: 2.35mm; Radiation Hardening: No; Lead Free: Lead Free; RoHS Compliant: Yes; REACH SVHC: No SVHC; ComponentLink1URL: https://datasheet.ciiva.com/7747/1635564-7747846.pdf?src-supplier=Element14; ComponentLink1Description: https://datasheet.ciiva.com/7747/1635564-7747846.pdf?src-supplier=Element14; ComponentLink2URL: https://datasheet.ciiva.com/15086/getdatasheetpartid-250110-15086515.pdf?src-supplier=Verical; ComponentLink2Description: https://datasheet.ciiva.com/15086/getdatasheetpartid-250110-15086515.pdf?src-supplier=Verical; ComponentLink3URL: https://datasheet.ciiva.com/1837/sn74hc245-1837904.pdf?src-supplier=Digi-Key; ComponentLink3Description: https://datasheet.ciiva.com/1837/sn74hc245-1837904.pdf?src-supplier=Digi-Key; ComponentLink4URL: https://datasheet.ciiva.com/14300/sn54hc245-sp-14300744.pdf?src-supplier=Avnet; ComponentLink4Description: https://datasheet.ciiva.com/14300/sn54hc245-sp-14300744.pdf?src-supplier=Avnet; Supplier Part Number 1: SN74HC245DW

## Sheet power.SchDoc
size A2; SheetNumber: 7; SheetTotal: 9
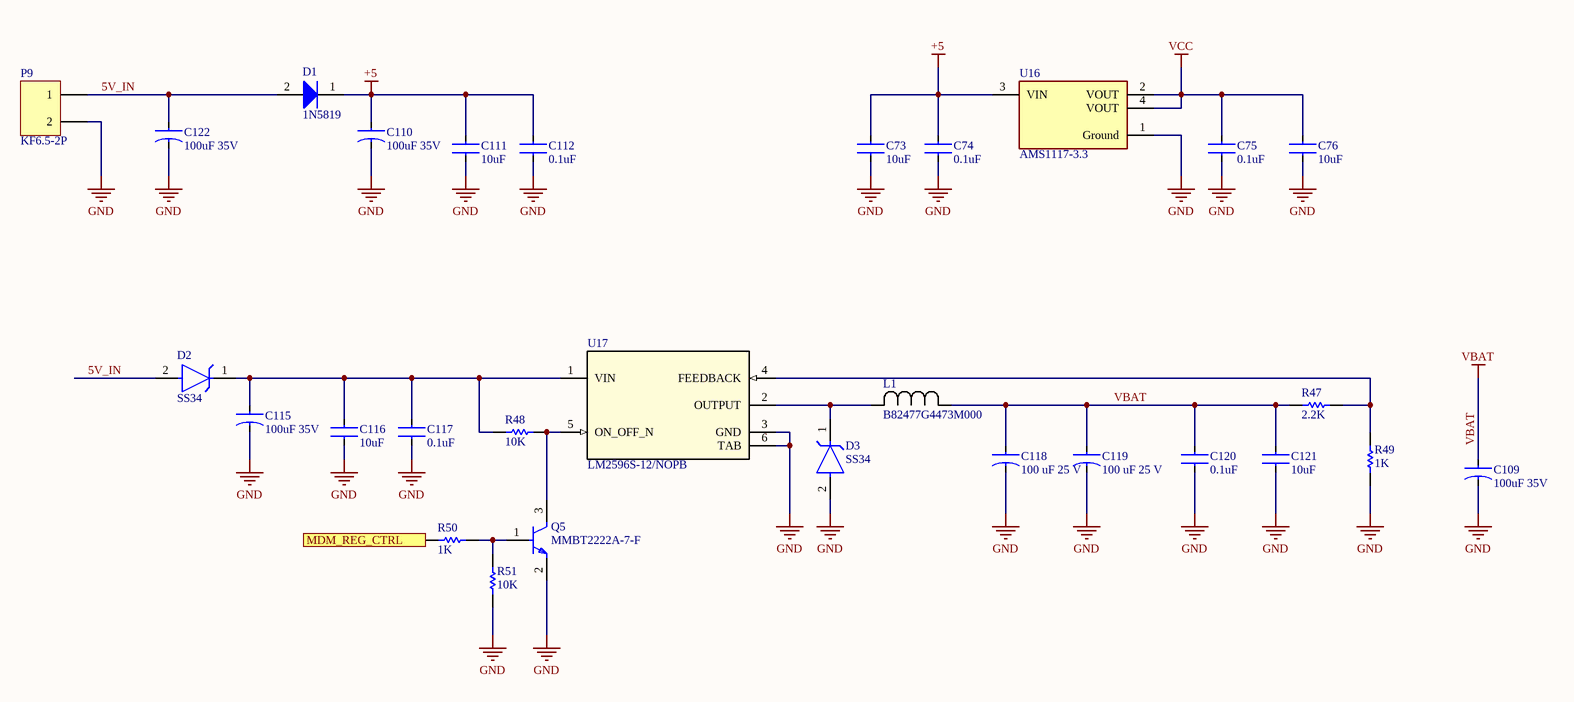
[diagram p8: power.SchDoc]

### Parts
C73  10uF  [C0402]
C74  0.1uF  [C0402]
C75  0.1uF  [C0402]
C76  10uF  [C0402]
C109  100uF 35V  [CAP_J-V_10X10P5_RUB]
C110  100uF 35V  [CAP_J-V_10X10P5_RUB]
C111  10uF  [C0402]
C112  0.1uF  [C0402]
C115  100uF 35V  [CAP_J-V_10X10P5_RUB]
C116  10uF  [C0402]
C117  0.1uF  [C0402]
C118  100 uF 25 V  [CAP_J-V_10X10P5_RUB]
C119  100 uF 25 V  [CAP_J-V_10X10P5_RUB]
C120  0.1uF  [C0402]
C121  10uF  [C0402]
C122  100uF 35V  [CAP_J-V_10X10P5_RUB]
D1  1N5819  [SMA (DO-214AC)]
D2  SS34  [SMA (DO-214AC)]
D3  SS34  [SMA (DO-214AC)]
L1  B82477G4473M000  [IND_EPCOS_B82477G4_EPC]
P9  KF6.5-2P  [KF6.5 2P 11mm]
Q5  MMBT2222A-7-F  [SOT-23-3L_AOS]
R47  2.2K  [R0402]
R48  10K  [R0402]
R49  1K  [R0402]
R50  1K  [R0402]
R51  10K  [R0402]
U16  AMS1117-3.3  [Advanced_Monolithic_Systems_AMS1117_IPC_A]
U17  LM2596S-12/NOPB  [KTT0005B]

### Ports
MDM_REG_CTRL

### Nets
+5: C73.1 C74.1 C110.1 C111.1 C112.1 D1.1(K) U16.3(VIN)
GND: C73.2 C74.2 C75.2 C76.2 C109.2 C110.2 C111.2 C112.2 C115.2 C116.2 C117.2 C118.2 C119.2 C120.2 C121.2 C122.2 D3.2(A) P9.2 Q5.2(E) R49.1 R51.1 U16.1(Ground) U17.3(GND) U17.6(TAB)
VBAT: C109.1 C118.1 C119.1 C120.1 C121.1 L1.1 R47.2
VCC: C75.1 C76.1 U16.2(VOUT) U16.4(VOUT)
5V_IN: C122.1 D1.2(A) D2.2(A) P9.1
MDM_REG_CTRL: R50.1 ; port MDM_REG_CTRL
NetC115_1: C115.1 C116.1 C117.1 D2.1(C) R48.2 U17.1(VIN)
NetD3_1: D3.1(C) L1.2 U17.2(OUTPUT)
NetQ5_1: Q5.1(B) R50.2 R51.2
NetQ5_3: Q5.3(C) R48.1 U17.5(ON_OFF_N)
NetR47_1: R47.1 R49.2 U17.4(FEEDBACK)

### Notes on the sheet
- CONFIDENTAL. Do not distribute.
- Page Contents:
- Title:
- Company
- Logo
- Date:
- SIZE:
- A2
- DWG Num:
- Time:
- Variant:
- Sheet
- Revision:
- of
- Drawn by:
- Checked by:

### Library data of the parts
C73 C76 C111 C116 C121 = CL31B106KOHNNNE: as C65 on sheet memory; Supplier 1: Future Electronics; Manufacturer Part Number: CL31B106KOHNNNE; RoHS: Yes; Category: Ceramic Capacitors; Stock 1: 116000; Pricing 1: 2000=0.03800, 6000=0.03460, 8000=0.03450, 20000=0.03420, 30000=0.03400 (USD); Mount: Surface Mount; Case/Package: 1206; Case Code (Metric): 3216; Case Code (Imperial): 1206; Material: Ceramic; Contact Plating: Tin; Min Operating Temperature: -55°C; Max Operating Temperature: 125°C; Capacitance: 10uF; Tolerance: 10%; Dielectric: X7R; Package Quantity: 1; Packaging: Tape and Reel; Voltage Rating: 16V; Series: CL; Length: 3.2mm; Width: 0.063inch; Height: 1.6mm; Thickness: 0.071inch; Depth: 1.6mm; RoHS Compliant: Yes; ComponentLink1URL: https://datasheet.ciiva.com/25795/cl31b106kohnnne-25795201.pdf?src-supplier=Digi-Key; ComponentLink1Description: https://datasheet.ciiva.com/25795/cl31b106kohnnne-25795201.pdf?src-supplier=Digi-Key; ComponentLink2URL: https://datasheet.ciiva.com/29201/452535-da-01-en-vs-kondensator-1206-29201132.pdf?src-supplier=Conrad; ComponentLink2Description: https://datasheet.ciiva.com/29201/452535-da-01-en-vs-kondensator-1206-29201132.pdf?src-supplier=Conrad; Supplier Part Number 1: 2558872
C74 C75 C112 C117 C120 = CL31B104KBCNNNC: as C66 on sheet memory; Supplier 1: Arrow Electronics; Manufacturer: Samsung; Manufacturer Part Number: CL31B104KBCNNNC; RoHS: Yes; Category: Ceramic Capacitors; Stock 1: 3508000; Pricing 1: 4000=0.02060, 8000=0.01660 (USD); Mount: Surface Mount; Case/Package: 1206; Case Code (Metric): 3216; Case Code (Imperial): 1206; Material: Ceramic; Contact Plating: Tin; Min Operating Temperature: -55°C; Max Operating Temperature: 125°C; Capacitance: 100nF; Voltage Rating (DC): 50V; Packaging: Tape and Reel; Voltage Rating: 50V; Series: CL; Length: 3.2mm; Width: 0.063inch; Height: 0.85mm; Depth: 1.6mm; Thickness: 0.037inch; Radiation Hardening: No; Lead Free: Lead Free; RoHS Compliant: Yes; ComponentLink1URL: https://datasheet.ciiva.com/25710/cl31b104kbcnnnc-25710293.pdf?src-supplier=Digi-Key; ComponentLink1Description: https://datasheet.ciiva.com/25710/cl31b104kbcnnnc-25710293.pdf?src-supplier=Digi-Key; ComponentLink2URL: https://datasheet.ciiva.com/29201/451941-da-01-en-vs-kondensator-1206-29201689.pdf?src-supplier=Conrad; ComponentLink2Description: https://datasheet.ciiva.com/29201/451941-da-01-en-vs-kondensator-1206-29201689.pdf?src-supplier=Conrad; ComponentLink3URL: https://datasheet.ciiva.com/16298/cl05b104kq5nnnc-16298186.pdf?src-supplier=Future+Electronics; ComponentLink3Description: https://datasheet.ciiva.com/16298/cl05b104kq5nnnc-16298186.pdf?src-supplier=Future+Electronics; Supplier Part Number 1: CL31B104KBCNNNC
C109 C110 C115 C122 = 100 uF 35 V Electrolytic Capacitors Radial: Aluminum Electrolytic Capacitors Radial, Can - 1000 Hrs @ 105°C; Manufacturer: Panasonic; Manufacturer Part Number: EEU-HD1V101; Tolerance: 20%; Ripple Current: 150mA; Life (Hours): 1000Hour; Lead/Base Style: Straight; Polarity: Polar; Lead Diameter: 0.5mm; Supplier 1: Digi-Key; RoHS: Yes; Category: Aluminum Electrolytic Capacitors; Pricing 1: 1=0.85000, 10=0.60000, 50=0.45340, 100=0.39500, 500=0.29256, 1000=0.24868, 2500=0.23405, 5000=0.21942 (USD); Mount: Through Hole; Case/Package: Radial; Number of Pins: 2; Min Operating Temperature: -55°C; Max Operating Temperature: 105°C; Capacitance: 100uF; Packaging: Bulk; Voltage Rating: 35V; Package Quantity: 200; Voltage Rating (DC): 35V; Termination: Radial; Ripple Current (AC): 150mA; Voltage: 35V; Series: HD; Construction: RADIAL; Diameter: 6.3mm; Length: 11.2mm; Height: 11.2mm; Lead Pitch: 2.5mm; Height - Seated (Max): 0.5inch; Radiation Hardening: No; REACH SVHC: No SVHC; Lead Free: Lead Free; RoHS Compliant: Yes; ComponentLink1URL: https://datasheet.ciiva.com/11779/0900766b80fe5b03-11779839.pdf?src-supplier=RSComponents; ComponentLink1Description: https://datasheet.ciiva.com/11779/0900766b80fe5b03-11779839.pdf?src-supplier=RSComponents; Supplier Part Number 1: P15169-ND
C118 C119 = 100 uF 25 V Electrolytic Capacitor: RZ Series Radial 25 V 100 uF Ø 6.3 x 11 mm 105 °C Electrolytic Capacitor; Manufacturer: Samwha; Manufacturer Part Number: RZ1E107M6L011BB280; Capacitance: 100uF; Voltage Rating: 25V; Supplier 1: Future Electronics; RoHS: Yes; Pricing 1: 3600=0.03300 (USD); Case/Package: Radial; Lead Free: Lead Free; ComponentLink1URL: http://www.samwha.com/electric/product/list_pdf2/RZ.pdf?src-supplier=Future+Electronics; ComponentLink1Description: http://www.samwha.com/electric/product/list_pdf2/RZ.pdf?src-supplier=Future+Electronics; Supplier Part Number 1: 1048642
D1 = 1N5819RLG: Rectifier, 2-Pin Axial_Lead, Pb-Free, Tape and Reel; Manufacturer: On Semiconductor; IFSM Max (A): 25; Configuration: Single; ComponentLink1Description: Manufacturer URL; ComponentLink2Description: Datasheet; ComponentLink3Description: Package Specification; Mounting Technology: Through Hole; ComponentLink3URL: http://www.onsemi.cn/pub_link/Collateral/59-10.PDF; DatasheetVersion: Rev. 10; ComponentLink1URL: http://www.onsemi.com/; Packing: Tape and Reel; PackageVersion: Rev. U, 02/2005; PartNumber: 1N5819RLG; PackageDescription: 2-Pin, Axial Lead, Diameter 2.35 mm; ComponentLink2URL: http://www.onsemi.cn/pub_link/Collateral/1N5817-D.PDF; RoHS: TRUE; PackageReference: AXIAL_LEAD-2-59-10; Supplier 1: Newark; Supplier Part Number 1: 18C9038
D2 D3 = SS34: DIODE SCHOTTKY 40V 3A SMC; Supplier 1: Newark; Supplier Part Number 1: 05R5898
L1 = B82477G4473M000: No Description Available; Mfr_Name: TDK; Type: DEV; Copyright: Copyright (C) 2022 Ultra Librarian. All rights reserved.; Manufacturer_Part_Number: B82477G4473M000; RefDes: RefDes
P9 = KF6.5-2P Barrier Terminal Block: KF6.5 2P  Barrier Terminal Block, 11mm spacing barrier terminals with side expandable slot. The terminal accepts wire gauge of 22~12AWG. Connectors are available black PA66 material.
Q5 = MMBT2222A-7-F: NPN Ic=600mA Vceo=40V hfe=100~300 fT=300MHz P=310mW SOT-23; Manufacturer: Diodes; hFE Min: 100; Frequency: 300MHz; Max Power Dissipation: 300mW; Number of Elements: 1; Collector Emitter Voltage (VCEO): 40V; Collector Base Voltage (VCBO): 75V; Emitter Base Voltage (VEBO): 6V; Collector Emitter Saturation Voltage: 1V; Max Collector Current: 600mA; Power Dissipation: 350mW; Element Configuration: Single; Current: 1A; Supplier 1: RSComponents; Manufacturer Part Number: MMBT2222A-7-F; RoHS: Yes; Category: BJTs; Stock 1: 3000; Pricing 1: 3000=0.02700, 6000=0.02500, 12000=0.02400, 30000=0.02300, 60000=0.02100 (USD); Mount: Surface Mount; Case/Package: SOT-23; Number of Pins: 3; Weight: 0.000282oz; Contact Plating: Tin,Matte; Min Operating Temperature: -55°C; Max Operating Temperature: 150°C; Polarity: NPN; Packaging: Tape and Reel; Package Quantity: 3000; Continuous Collector Current: 600mA; Collector Emitter Breakdown Voltage: 40V; Transition Frequency: 300MHz; Max Breakdown Voltage: 40V; Max Frequency: 300MHz; Termination: SMD/SMT; Gain Bandwidth Product: 300MHz; Voltage Rating (DC): 40V; Current Rating: 600mA; Voltage: 40V; Collector-emitter Voltage-Max: 1V; Series: -; Length: 3.05mm; Width: 1.4mm; Height: 1mm; Radiation Hardening: No; REACH SVHC: No SVHC; Lead Free: Lead Free; RoHS Compliant: Yes; ComponentLink1URL: https://datasheet.ciiva.com/15139/getdatasheetpartid-82692-15139078.pdf?src-supplier=Verical; ComponentLink1Description: https://datasheet.ciiva.com/15139/getdatasheetpartid-82692-15139078.pdf?src-supplier=Verical; ComponentLink2URL: https://datasheet.ciiva.com/8029/ds30041-8029709.pdf?src-supplier=Element14; ComponentLink2Description: https://datasheet.ciiva.com/8029/ds30041-8029709.pdf?src-supplier=Element14; ComponentLink3URL: https://datasheet.ciiva.com/11201/ds30041-11201864.pdf?src-supplier=Avnet; ComponentLink3Description: https://datasheet.ciiva.com/11201/ds30041-11201864.pdf?src-supplier=Avnet; ComponentLink4URL: https://datasheet.ciiva.com/16199/ds30041-16199045.pdf?src-supplier=Future+Electronics; ComponentLink4Description: https://datasheet.ciiva.com/16199/ds30041-16199045.pdf?src-supplier=Future+Electronics; ComponentLink5URL: https://datasheet.ciiva.com/11198/ds30041-11198965.pdf?src-supplier=Avnet; ComponentLink5Description: https://datasheet.ciiva.com/11198/ds30041-11198965.pdf?src-supplier=Avnet; ComponentLink6URL: https://datasheet.ciiva.com/972/ds30041-972551.pdf?src-supplier=Digi-Key; ComponentLink6Description: https://datasheet.ciiva.com/972/ds30041-972551.pdf?src-supplier=Digi-Key; ComponentLink7URL: https://datasheet.ciiva.com/972/ds30041-972552.pdf?src-supplier=Digi-Key; ComponentLink7Description: https://datasheet.ciiva.com/972/ds30041-972552.pdf?src-supplier=Digi-Key; ComponentLink8URL: https://datasheet.ciiva.com/972/ds30041-972550.pdf?src-supplier=Digi-Key; ComponentLink8Description: https://datasheet.ciiva.com/972/ds30041-972550.pdf?src-supplier=Digi-Key; Supplier Part Number 1: 1219442
R47 = RC1206FR-072K2L: Res Thick Film 1206 2.2K Ohm 1% 0.25W(1/4W) ±100ppm/C Pad SMD T/R; Manufacturer: Yageo; Resistance: 2.2kR; Power Rating: 250mW; Temperature Coefficient: 100ppm/°C; Voltage Rating: 200V; Supplier 1: Arrow Electronics; Manufacturer Part Number: RC1206FR-072K2L; RoHS: Yes; Category: Chip SMD Resistors; Stock 1: 20000; Pricing 1: 5000=0.01010 (USD); Case/Package: 1206; Case Code (Metric): 3216; Case Code (Imperial): 1206; Weight: 0.000571oz; Size Code: 1206; Min Operating Temperature: -55°C; Max Operating Temperature: 155°C; Tolerance: 1%; Packaging: Tape and Reel; Package Quantity: 1; Resistor Type: Thick Film; Number of Terminations: 2; Termination: SMD/SMT; Max Power Dissipation: 250mW; Features: Moisture Resistant; Series: RC; Resistance Tolerance: 1%; Construction: Rectangular; Length: 3.2mm; Width: 1.6mm; Height: 0.55mm; Depth: 1.6mm; REACH SVHC: Unknown; Lead Free: Lead Free; Military Standard: Not; RoHS Compliant: Yes; ComponentLink1URL: https://datasheet.ciiva.com/2461/pyu-rc1206-51-rohs-l-4-2461489.pdf?src-supplier=Digi-Key; ComponentLink1Description: https://datasheet.ciiva.com/2461/pyu-rc1206-51-rohs-l-4-2461489.pdf?src-supplier=Digi-Key; ComponentLink2URL: https://datasheet.ciiva.com/2461/pyu-rc1206-51-rohs-l-4-2461490.pdf?src-supplier=Digi-Key; ComponentLink2Description: https://datasheet.ciiva.com/2461/pyu-rc1206-51-rohs-l-4-2461490.pdf?src-supplier=Digi-Key; ComponentLink3URL: https://datasheet.ciiva.com/2461/pyu-rc1206-51-rohs-l-4-2461488.pdf?src-supplier=Digi-Key; ComponentLink3Description: https://datasheet.ciiva.com/2461/pyu-rc1206-51-rohs-l-4-2461488.pdf?src-supplier=Digi-Key; ComponentLink4URL: https://datasheet.ciiva.com/16978/pyu-rc1206-51-rohs-l-4-16978023.pdf?src-supplier=Future+Electronics; ComponentLink4Description: https://datasheet.ciiva.com/16978/pyu-rc1206-51-rohs-l-4-16978023.pdf?src-supplier=Future+Electronics; Supplier Part Number 1: RC1206FR-072K2L
R48 R51 = RC1206FR-0710KL: Res Thick Film 1206 10K Ohm 1% 0.25W(1/4W) ±100ppm/C Pad SMD T/R; Manufacturer: Yageo; Resistance: 10kR; Temperature Coefficient: 100ppm/°C; Power Rating: 250mW; Voltage Rating: 200V; Supplier 1: Arrow Electronics; Manufacturer Part Number: RC1206FR-0710KL; RoHS: Yes; Category: Chip SMD Resistors; Stock 1: 10000; Pricing 1: 5000=0.00970 (USD); Case/Package: 1206; Case Code (Imperial): 1206; Case Code (Metric): 3216; Size Code: 1206; Min Operating Temperature: -55°C; Max Operating Temperature: 155°C; Tolerance: 1%; Packaging: Tape and Reel; Resistor Type: Thick Film; Package Quantity: 5000; Termination: SMD/SMT; Features: Moisture Resistant; Series: RC; Max Power Dissipation: 250mW; Number of Terminations: 2; Resistance Tolerance: 1%; Construction: Rectangular; Length: 3.1mm; Width: 1.6mm; Height: 0.55mm; Depth: 1.6mm; REACH SVHC: Unknown; Lead Free: Lead Free; Military Standard: Not; RoHS Compliant: Yes; ComponentLink1URL: https://datasheet.ciiva.com/46445/444357-46445703.pdf?src-supplier=Element14; ComponentLink1Description: https://datasheet.ciiva.com/46445/444357-46445703.pdf?src-supplier=Element14; ComponentLink2URL: https://datasheet.ciiva.com/7857/1692832-7857244.pdf?src-supplier=Element14; ComponentLink2Description: https://datasheet.ciiva.com/7857/1692832-7857244.pdf?src-supplier=Element14; ComponentLink3URL: https://datasheet.ciiva.com/7857/1692832-7857245.pdf?src-supplier=Element14; ComponentLink3Description: https://datasheet.ciiva.com/7857/1692832-7857245.pdf?src-supplier=Element14; Supplier Part Number 1: RC1206FR-0710KL
R49 R50 = RC1206FR-071KL: In a Pack of 5000, 1K 1206 Thick Film SMD Resistor ±1% 0.25W - RC1206FR-071KL; Manufacturer: Yageo; Resistance: 1kR; Power Rating: 250mW; Voltage Rating: 200V; Temperature Coefficient: 100ppm/°C; Supplier 1: Arrow Electronics; Manufacturer Part Number: RC1206FR-071KL; RoHS: Yes; Category: Chip SMD Resistors; Stock 1: 535000; Pricing 1: 5000=0.00940, 10000=0.00890 (USD); Case/Package: 1206; Case Code (Imperial): 1206; Case Code (Metric): 3216; Size Code: 1206; Min Operating Temperature: -55°C; Max Operating Temperature: 155°C; Tolerance: 1%; Packaging: Tape and Reel; Resistor Type: Thick Film; Termination: SMD/SMT; Series: RC; Resistance Tolerance: 1%; Construction: Rectangular; Technology: THICK FILM; Length: 3.1mm; Height: 0.55mm; Depth: 1.6mm; REACH SVHC: Unknown; Military Standard: Not; Lead Free: Lead Free; RoHS Compliant: Yes; ComponentLink1URL: https://datasheet.ciiva.com/11808/0900766b80c6630a-11808217.pdf?src-supplier=RSComponents; ComponentLink1Description: https://datasheet.ciiva.com/11808/0900766b80c6630a-11808217.pdf?src-supplier=RSComponents; ComponentLink2URL: https://datasheet.ciiva.com/29181/402540-da-01-en-smd-widerstand-chip1206-1-kohm-29181462.pdf?src-supplier=Conrad; ComponentLink2Description: https://datasheet.ciiva.com/29181/402540-da-01-en-smd-widerstand-chip1206-1-kohm-29181462.pdf?src-supplier=Conrad; ComponentLink3URL: https://datasheet.ciiva.com/46445/444357-46445708.pdf?src-supplier=Element14; ComponentLink3Description: https://datasheet.ciiva.com/46445/444357-46445708.pdf?src-supplier=Element14; Supplier Part Number 1: RC1206FR-071KL
U16 = AMS1117-3.3: Fixed 15V 3.3V 1.3V @ 800mA SOT-223 Dropout Regulators(LDO) RoHS
U17 = LM2596S-12/NOPB: No Description Available; Mfr_Name: Texas Instruments; PartNumber: LM2596SX-ADJ/NOPB; Alternate_PartNumber: LM2596S-ADJ/NOPB; CompType: IC; Type: DEV; RefDes: RefDes; Copyright: Copyright (C) 2022 Ultra Librarian. All rights reserved.; Manufacturer_Part_Number: LM2596S-12/NOPB; PackageReference: KTT0005B; MountType: SMT; RoHS: Y; Manufacturer: Texas Instruments